# EAGLE design driver_board_v1 (EAGLE 6.5.0)
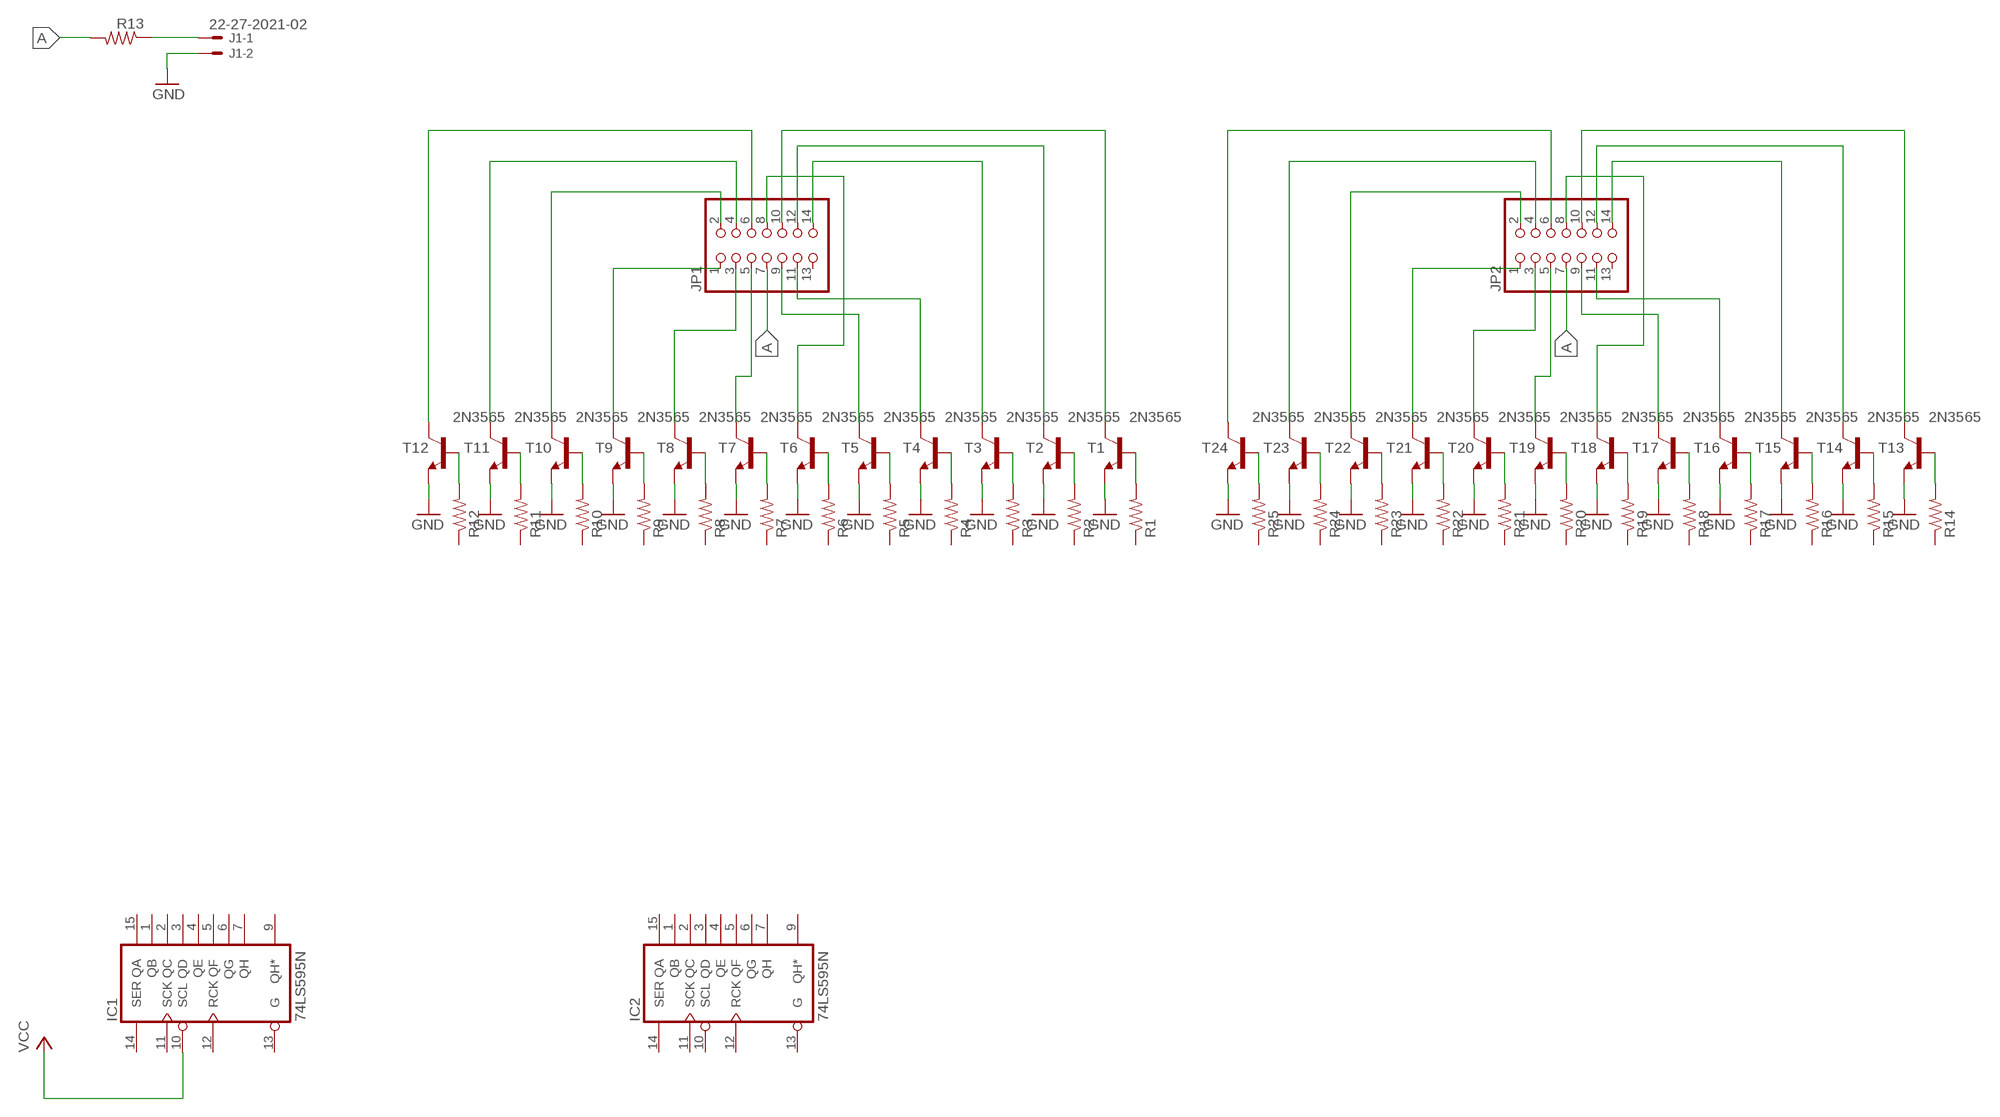
[diagram p0: schematic, sheet 1]

## Parts
IC1  74LS595N  [DIL16]
IC2  74LS595N  [DIL16]
J1  22-27-2021-02  [6410-02]
JP1  PINHD-2X7  [2X07]
JP2  PINHD-2X7  [2X07]
R1  R-US_0204/7  [0204/7]
R2  R-US_0204/7  [0204/7]
R3  R-US_0204/7  [0204/7]
R4  R-US_0204/7  [0204/7]
R5  R-US_0204/7  [0204/7]
R6  R-US_0204/7  [0204/7]
R7  R-US_0204/7  [0204/7]
R8  R-US_0204/7  [0204/7]
R9  R-US_0204/7  [0204/7]
R10  R-US_0204/7  [0204/7]
R11  R-US_0204/7  [0204/7]
R12  R-US_0204/7  [0204/7]
R13  R-US_0204/7  [0204/7]
R14  R-US_0204/7  [0204/7]
R15  R-US_0204/7  [0204/7]
R16  R-US_0204/7  [0204/7]
R17  R-US_0204/7  [0204/7]
R18  R-US_0204/7  [0204/7]
R19  R-US_0204/7  [0204/7]
R20  R-US_0204/7  [0204/7]
R21  R-US_0204/7  [0204/7]
R22  R-US_0204/7  [0204/7]
R23  R-US_0204/7  [0204/7]
R24  R-US_0204/7  [0204/7]
R25  R-US_0204/7  [0204/7]
T1  2N3565  [TO92]
T2  2N3565  [TO92]
T3  2N3565  [TO92]
T4  2N3565  [TO92]
T5  2N3565  [TO92]
T6  2N3565  [TO92]
T7  2N3565  [TO92]
T8  2N3565  [TO92]
T9  2N3565  [TO92]
T10  2N3565  [TO92]
T11  2N3565  [TO92]
T12  2N3565  [TO92]
T13  2N3565  [TO92]
T14  2N3565  [TO92]
T15  2N3565  [TO92]
T16  2N3565  [TO92]
T17  2N3565  [TO92]
T18  2N3565  [TO92]
T19  2N3565  [TO92]
T20  2N3565  [TO92]
T21  2N3565  [TO92]
T22  2N3565  [TO92]
T23  2N3565  [TO92]
T24  2N3565  [TO92]

## Nets
A: JP1.7 JP2.7 R13.2
GND: J1.2 T1.3(E) T2.3(E) T3.3(E) T4.3(E) T5.3(E) T6.3(E) T7.3(E) T8.3(E) T9.3(E) T10.3(E) T11.3(E) T12.3(E) T13.3(E) T14.3(E) T15.3(E) T16.3(E) T17.3(E) T18.3(E) T19.3(E) T20.3(E) T21.3(E) T22.3(E) T23.3(E) T24.3(E)
N$1: R12.2 T12.2(B)
N$2: R11.2 T11.2(B)
N$3: R10.2 T10.2(B)
N$4: R9.2 T9.2(B)
N$5: R8.2 T8.2(B)
N$6: R7.2 T7.2(B)
N$7: R6.2 T6.2(B)
N$8: R5.2 T5.2(B)
N$9: R4.2 T4.2(B)
N$10: R3.2 T3.2(B)
N$11: R2.2 T2.2(B)
N$12: R1.2 T1.2(B)
N$13: JP1.6 T12.1(C)
N$14: JP1.4 T11.1(C)
N$15: JP1.2 T10.1(C)
N$16: JP1.1 T9.1(C)
N$17: JP1.3 T8.1(C)
N$18: JP1.5 T7.1(C)
N$19: JP1.10 T1.1(C)
N$20: JP1.12 T2.1(C)
N$21: JP1.14 T3.1(C)
N$22: JP1.8 T6.1(C)
N$23: JP1.9 T5.1(C)
N$24: JP1.11 T4.1(C)
N$25: J1.1 R13.1
N$26: R25.2 T24.2(B)
N$27: R24.2 T23.2(B)
N$28: R23.2 T22.2(B)
N$29: R22.2 T21.2(B)
N$30: R21.2 T20.2(B)
N$31: R20.2 T19.2(B)
N$32: R19.2 T18.2(B)
N$33: R18.2 T17.2(B)
N$34: R17.2 T16.2(B)
N$35: R16.2 T15.2(B)
N$36: R15.2 T14.2(B)
N$37: R14.2 T13.2(B)
N$38: JP2.6 T24.1(C)
N$39: JP2.4 T23.1(C)
N$40: JP2.2 T22.1(C)
N$41: JP2.1 T21.1(C)
N$42: JP2.3 T20.1(C)
N$43: JP2.5 T19.1(C)
N$44: JP2.10 T13.1(C)
N$45: JP2.12 T14.1(C)
N$46: JP2.14 T15.1(C)
N$47: JP2.8 T18.1(C)
N$48: JP2.9 T17.1(C)
N$49: JP2.11 T16.1(C)
VCC: IC1.10(SCL)
Unconnected: IC1.1(QB) IC1.2(QC) IC1.3(QD) IC1.4(QE) IC1.5(QF) IC1.6(QG) IC1.7(QH) IC1.9(QH*) IC1.11(SCK) IC1.12(RCK) IC1.13(G) IC1.14(SER) IC1.15(QA) IC2.1(QB) IC2.2(QC) IC2.3(QD) IC2.4(QE) IC2.5(QF) IC2.6(QG) IC2.7(QH) IC2.9(QH*) IC2.10(SCL) IC2.11(SCK) IC2.12(RCK) IC2.13(G) IC2.14(SER) IC2.15(QA) JP1.13 JP2.13 R1.1 R2.1 R3.1 R4.1 R5.1 R6.1 R7.1 R8.1 R9.1 R10.1 R11.1 R12.1 R14.1 R15.1 R16.1 R17.1 R18.1 R19.1 R20.1 R21.1 R22.1 R23.1 R24.1 R25.1

## Power pins joined to a net without a drawn wire
GND: IC1.8(GND) IC2.8(GND)
VCC: IC1.16(VCC) IC2.16(VCC)

## Library data of the parts
IC1 IC2 = 74xx-us:74*595: 8-bit SHIFT REGISTER, output latch
J1 = con-molex:22-?-02: CONNECTOR wire to board 2.54 mm (.1 inch) pitch header; OC_FARNELL: unknown; OC_NEWARK: unknown
JP1 JP2 = pinhead:PINHD-2X7: PIN HEADER
R1-R25 = resistor:R-US_: RESISTOR, American symbol
T1-T24 = transistor:2N3565: NPN TRANSISTOR

## Board
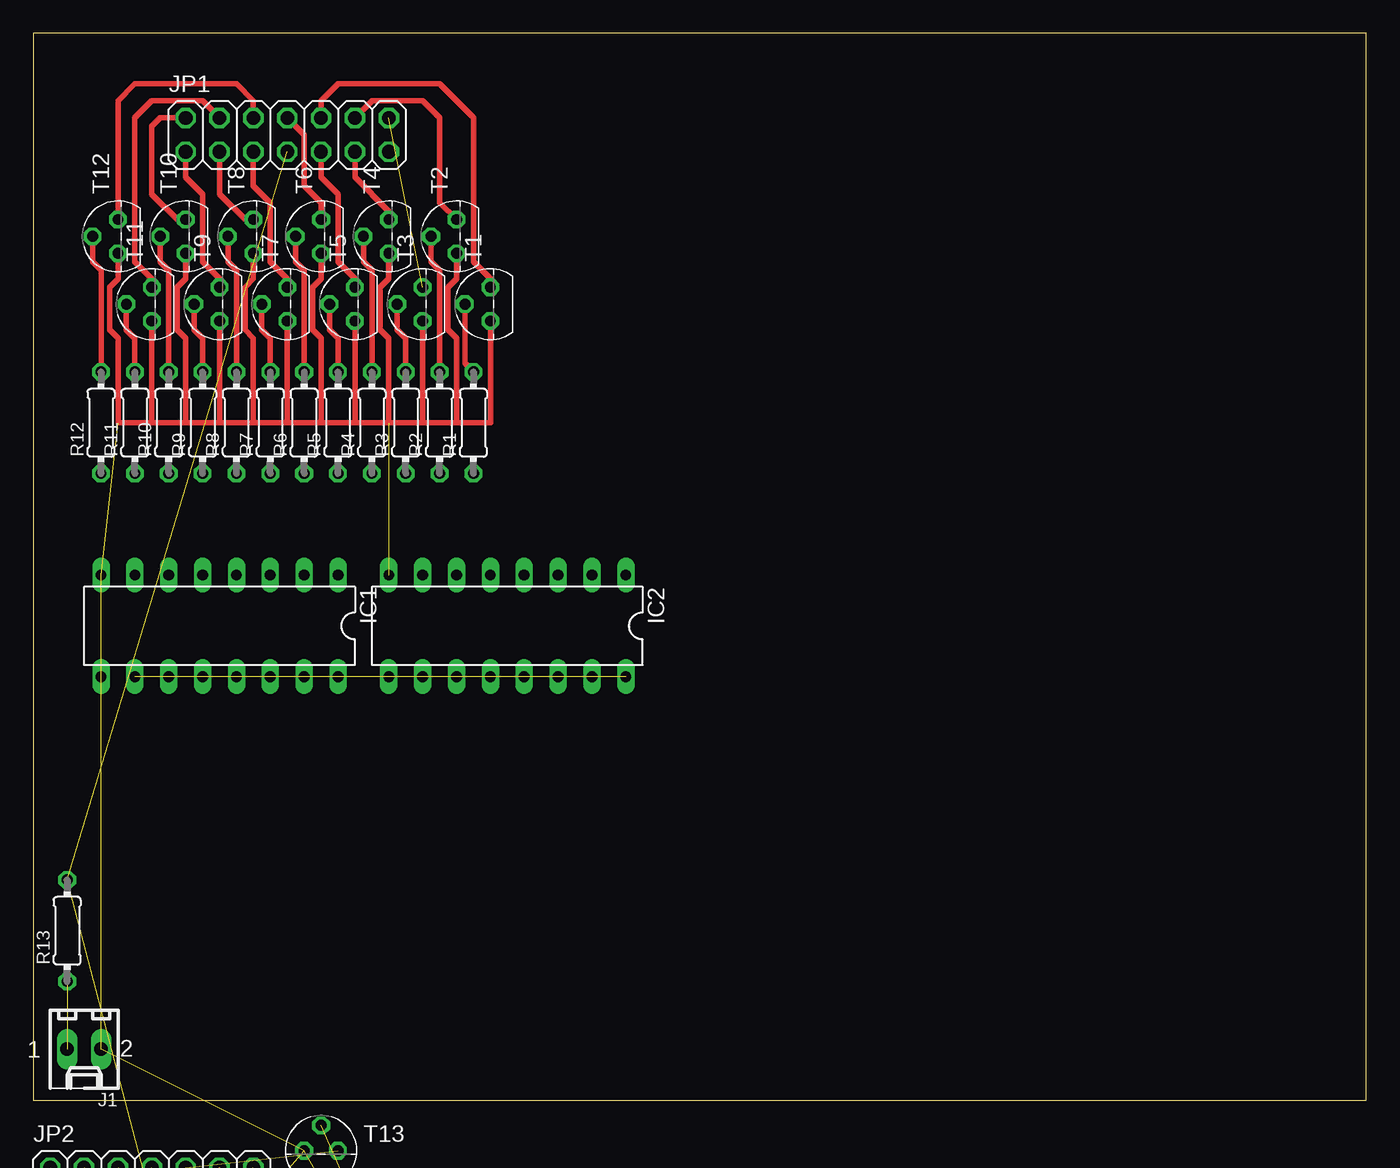
[diagram p1: board, top side]

Size 100 x 80 mm. Coordinates in mm from the lower left corner, seen from the top.
Outline: 0,0 100,0 100,80 0,80 0,0
Copper layers (1*16): Top 0.035mm / dielectric 1.5mm / Bottom 0.035mm
Design rules "default": minimum track width 10mil, minimum drill 24mil, track to track 8mil, track to pad 8mil, pad to pad 8mil, via to via 8mil, smd to smd 8mil, copper to edge 40mil, drill to drill 8mil, minimum pad ring 10mil, minimum via ring 8mil, stop-mask expansion 4mil, vias tented up to drill 0mil, thermal gap 10mil

### Footprints (pad centres in the part's own frame; a part is rotated, then mirrored left to right if it is on the bottom)
DIL16 = drill 0.813 long: 1 -8.89,-3.81; 2 -6.35,-3.81; 3 -3.81,-3.81; 4 -1.27,-3.81; 5 1.27,-3.81; 6 3.81,-3.81; 7 6.35,-3.81; 8 8.89,-3.81; 9 8.89,3.81; 10 6.35,3.81; 11 3.81,3.81; 12 1.27,3.81; 13 -1.27,3.81; 14 -3.81,3.81; 15 -6.35,3.81; 16 -8.89,3.81
6410-02 = drill 1.016 long: 1 1.27,0; 2 -1.27,0
2X07 = drill 1.016 octagon: 1 -7.62,-1.27; 2 -7.62,1.27; 3 -5.08,-1.27; 4 -5.08,1.27; 5 -2.54,-1.27; 6 -2.54,1.27; 7 0,-1.27; 8 0,1.27; 9 2.54,-1.27; 10 2.54,1.27; 11 5.08,-1.27; 12 5.08,1.27; 13 7.62,-1.27; 14 7.62,1.27
0204/7 = drill 0.813 octagon: 1 -3.81,0; 2 3.81,0
TO92 = drill 0.813 octagon: 1 1.27,0; 2 0,1.905; 3 -1.27,0

### Placement (x,y rotation side)
IC1  13.97,35.56 180 top
IC2  35.56,35.56 180 top
J1  3.81,3.81 180 top
JP1  19.05,72.39 0 top
JP2  8.89,-6.35 0 top  (outside the outline)
R1  33.02,50.8 90 top
R2  30.48,50.8 90 top
R3  27.94,50.8 90 top
R4  25.4,50.8 90 top
R5  22.86,50.8 90 top
R6  20.32,50.8 90 top
R7  17.78,50.8 90 top
R8  15.24,50.8 90 top
R9  12.7,50.8 90 top
R10  10.16,50.8 90 top
R11  7.62,50.8 90 top
R12  5.08,50.8 90 top
R13  2.54,12.7 90 top
R14  29.21,-27.94 0 top  (outside the outline)
R15  3.81,-33.02 0 top  (outside the outline)
R16  13.97,-33.02 0 top  (outside the outline)
R17  24.13,-33.02 0 top  (outside the outline)
R18  3.81,-36.83 0 top  (outside the outline)
R19  13.97,-36.83 0 top  (outside the outline)
R20  24.13,-36.83 0 top  (outside the outline)
R21  3.81,-40.64 0 top  (outside the outline)
R22  13.97,-40.64 0 top  (outside the outline)
R23  24.13,-40.64 0 top  (outside the outline)
R24  3.81,-44.45 0 top  (outside the outline)
R25  13.97,-44.45 0 top  (outside the outline)
T1  34.29,59.69 90 top
T2  31.75,64.77 90 top
T3  29.21,59.69 90 top
T4  26.67,64.77 90 top
T5  24.13,59.69 90 top
T6  21.59,64.77 90 top
T7  19.05,59.69 90 top
T8  16.51,64.77 90 top
T9  13.97,59.69 90 top
T10  11.43,64.77 90 top
T11  8.89,59.69 90 top
T12  6.35,64.77 90 top
T13  21.59,-3.81 0 top
T14  1.27,-12.7 0 top  (outside the outline)
T15  13.97,-12.7 0 top  (outside the outline)
T16  26.67,-12.7 0 top  (outside the outline)
T17  1.27,-17.78 0 top  (outside the outline)
T18  13.97,-17.78 0 top  (outside the outline)
T19  26.67,-17.78 0 top  (outside the outline)
T20  1.27,-22.86 0 top  (outside the outline)
T21  13.97,-22.86 0 top  (outside the outline)
T22  26.67,-22.86 0 top  (outside the outline)
T23  1.27,-27.94 0 top  (outside the outline)
T24  13.97,-27.94 0 top  (outside the outline)

### Tracks (layer width: path | path; a pad name or v marks a point on that pad's centre or on a via)
A  (2 unrouted)
GND  (15 unrouted)
  Top 0.406: T11.3 8.89,50.8 | 8.89,50.8 11.43,50.8 | 11.43,50.8 13.97,50.8 | 13.97,50.8 T9.3 | T10.3 11.43,61.59 10.79,60.96 10.79,57.78 11.43,57.15 11.43,50.8 | T12.3 6.35,61.59 5.71,60.96 5.71,57.78 6.35,57.15 6.35,50.8 8.89,50.8 | T8.3 16.51,61.59 15.88,60.96 15.88,57.78 16.51,57.15 16.51,50.8 | 16.51,50.8 19.05,50.8 | 19.05,50.8 T7.3 | T5.3 24.13,50.8 | 24.13,50.8 21.59,50.8 | 21.59,50.8 19.05,50.8 | T3.3 29.21,50.8 | 29.21,50.8 26.67,50.8 | 26.67,50.8 24.13,50.8 | 16.51,50.8 13.97,50.8 | T1.3 34.29,50.8 31.75,50.8 | 31.75,50.8 29.21,50.8 | T2.3 31.75,61.59 31.11,60.96 31.11,57.78 31.75,57.15 31.75,50.8 | T4.3 26.67,61.59 26.04,60.96 26.04,57.78 26.67,57.15 26.67,50.8 | T6.3 21.59,61.59 20.95,60.96 20.95,57.78 21.59,57.15 21.59,50.8
N$1
  Top 0.406: T12.2 4.45,62.87 5.08,62.23 R12.2
N$2
  Top 0.406: T11.2 6.99,57.78 7.62,57.15 R11.2
N$3
  Top 0.406: T10.2 9.53,62.87 10.16,62.23 R10.2
N$4
  Top 0.406: T9.2 12.06,57.78 12.7,57.15 R9.2
N$5
  Top 0.406: R8.2 15.24,62.23 14.61,62.87 T8.2
N$6
  Top 0.406: R7.2 17.78,57.15 17.14,57.78 T7.2
N$7
  Top 0.406: R6.2 20.32,62.23 19.68,62.87 T6.2
N$8
  Top 0.406: R5.2 22.86,57.15 22.23,57.78 T5.2
N$9
  Top 0.406: R4.2 25.4,62.23 24.77,62.87 T4.2
N$10
  Top 0.406: R3.2 27.94,57.15 27.3,57.78 T3.2
N$11
  Top 0.406: R2.2 30.48,62.23 29.84,62.87 T2.2
N$12
  Top 0.406: R1.2 32.38,55.24 T1.2
N$13
  Top 0.406: T12.1 6.35,74.93 7.62,76.2 15.24,76.2 16.51,74.93 JP1.6
N$14
  Top 0.406: JP1.4 12.7,74.93 8.89,74.93 7.62,73.66 7.62,62.87 8.89,61.59 T11.1
N$15
  Top 0.406: JP1.2 9.53,73.66 8.89,73.03 8.89,67.94 10.79,66.04 T10.1
N$16
  Top 0.406: JP1.1 11.43,69.22 12.7,67.94 12.7,62.87 13.97,61.59 T9.1
N$17
  Top 0.406: JP1.3 13.97,67.94 15.88,66.04 T8.1
N$18
  Top 0.406: JP1.5 16.51,68.58 17.78,67.31 17.78,62.87 19.05,61.59 T7.1
N$19
  Top 0.406: JP1.10 21.59,74.93 22.86,76.2 30.48,76.2 33.02,73.66 33.02,62.87 34.29,61.59 T1.1
N$20
  Top 0.406: JP1.12 25.4,74.93 29.21,74.93 30.48,73.66 30.48,67.31 T2.1
N$21  (1 unrouted)
N$22
  Top 0.406: T6.1 21.59,67.31 20.32,68.58 20.32,72.39 JP1.8
N$23
  Top 0.406: JP1.9 21.59,69.22 22.86,67.94 22.86,62.87 24.13,61.59 T5.1
N$24
  Top 0.406: JP1.11 24.13,69.22 26.67,66.67 T4.1
N$25  (1 unrouted)
N$26  (1 unrouted)
N$27  (1 unrouted)
N$28  (1 unrouted)
N$29  (1 unrouted)
N$30  (1 unrouted)
N$31  (1 unrouted)
N$32  (1 unrouted)
N$33  (1 unrouted)
N$34  (1 unrouted)
N$35  (1 unrouted)
N$36  (1 unrouted)
N$37  (1 unrouted)
N$38  (1 unrouted)
N$39  (1 unrouted)
N$40  (1 unrouted)
N$41  (1 unrouted)
N$42  (1 unrouted)
N$43  (1 unrouted)
N$44  (1 unrouted)
N$45  (1 unrouted)
N$46  (1 unrouted)
N$47  (1 unrouted)
N$48  (1 unrouted)
N$49  (1 unrouted)
VCC  (2 unrouted)